# Altium schematic sheet MAG_MMC5983MA.SchDoc
size 420 x 297 mm; SheetNumber: 7; SheetTotal: 13
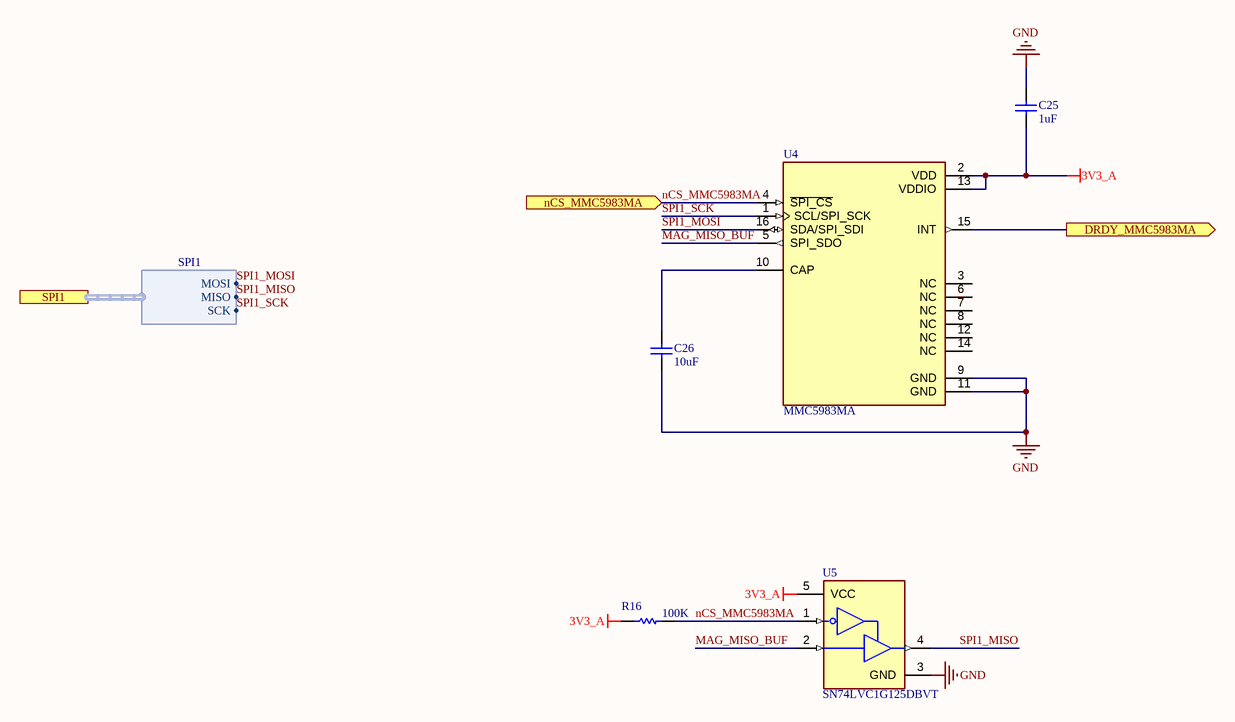
[diagram p0: MAG_MMC5983MA.SchDoc]

## Parts
C25  1uF  [CAPC1608X90X35LL15T15]
C26  10uF  [CAPC2013X145X50LL20T25]
R16  100K  [RESC1608X55X30ML20T10]
U4  MMC5983MA  [PQFN50P300X300X100-16N]
U5  SN74LVC1G125DBVT  [FP-DBV0005A-MFG]

## Ports
DRDY_MMC5983MA (out), nCS_MMC5983MA (in), SPI1 (harness SPI1)

## Harnesses
SPI1: MOSI, MISO, SCK

## Nets
3V3_A: C25.1 R16.2 U4.2(VDD) U4.13(VDDIO) U5.5(VCC)
GND: C25.2 C26.2 U4.9(GND) U4.11(GND) U5.3(GND)
DRDY_MMC5983MA: U4.15(INT) ; port DRDY_MMC5983MA
MAG_MISO_BUF: U4.5(SPI_SDO) U5.2(A)
nCS_MMC5983MA: R16.1 U4.4(~{SPI_CS}) U5.1(~{OE}) ; port nCS_MMC5983MA
SPI1_MISO: U5.4(Y) ; port SPI1.MISO
SPI1_MOSI: U4.16(SDA/SPI_SDI) ; port SPI1.MOSI
SPI1_SCK: U4.1(SCL/SPI_SCK) ; port SPI1.SCK
NetC26_1: C26.1 U4.10(CAP)

Not connected (* = marked no-connect by the designer): U4 3(NC) 6(NC) 7(NC) 8(NC) 12(NC) 14(NC)

## Notes on the sheet
- THIS DOCUMENT AND THE DATA DISCLOSED HEREIN OR
- HEREWITH IS THE PROPERTY OF ALTIUM LIMITED AND MAY
- DWG NO:
- REVISION
- REV:
- DESCRIPTION
- DATE
- APPROVED
- BE FREELY DISTRIBUTED IN WHOLE. NO RIGHTS ARE
- RESERVED OR EXPRESS OR IMPLIED WARANTEE GIVEN.
- ENG:
- APPROVALS
- PROJECT
- DSN:
- CHK:
- REFERENCE DOCUMENTS
- PROJECT REVISION:
- TITLE
- DOCUMENT REVISION:
- DESIGN ITEM:
- BOM:
- FAB DWG:
- PCB DWG:
- ASSY DWG:
- SCALE:
- A3
- SIZE
- CAGE CODE
- FILE NAME
- DWG NO.
- SHEET
- OF
- REV

## Library data of the parts
C25 = CMP-2006-02298-2: Manufacturer: Kemet; Part Number: C0603C105K4RACTU
C26 = CMP-2007-01044-1: Manufacturer: Kemet; Part Number: C0805C106K8RACTU
R16 = CMP-2000-01852-1: Part Number: RK73B1JTTD104J; Manufacturer: KOA Speer
U4 = CMP-051-000000-1: MMC5983 series Magnetic, Magnetometer Sensor Evaluation Board; MF: Memsic Inc.; Component Type: Standard; Price: None; Source: MMC5983MA.SchLib; Value: *; MP: MMC5983MA; Design Item ID: MMC5983MA; Package: VFLGA-16 Memsic Inc.; Pin Count: 16; Availability: In Stock; Purchase-URL: https://pricing.snapeda.com/search/part/MMC5983MA/?ref=eda; SnapEDA_Link: https://www.snapeda.com/parts/MMC5983MA/Memsic+Inc./view-part/?ref=snap; Check_prices: https://www.snapeda.com/parts/MMC5983MA/Memsic+Inc./view-part/?ref=eda
U5 = CMP-0859-00018-4: IC BUF NON-INVERT 5.5V SOT23-5; Manufacturer: Texas Instruments; Min Supply Voltage: 1.65V; Number Of Outputs: 1; Propagation Delay: 4.2ns; Logic Function Desc: Non-Inverting; Nominal Supply Current: 10uA; Standoff Height: 0mm; ComponentLink2Description: Datasheet; Temperature Range High: +125°C; Octopart: https://octopart.com/sn74lvc1g125dbvt-texas+instruments-1006799; Ambient Temperature Range Low: -40°C; Temperature: -40°C to +125°C; Mouser Description: Buffers & Line Drivers SNGL Bus Buffer Gate; Automotive: No; RoHS: TRUE; Device Class L2: Logic ICs; Ambient Temperature Range High: +125°C; ComponentLink2URL: http://www.ti.com/lit/ds/symlink/sn74lvc1g125.pdf; Height: 1.45mm; Number Of Circuits: 1; Device Class L1: Integrated Circuits (ICs); Max Supply Voltage: 5.5V; Manufacturer Part Number: SN74LVC1G125DBVT; Temperature Range Low: -40°C; Package: DBV0005A; Device Class L3: Logic Gates; Number Of Inputs: 1; Lead Free: Yes; Category: IC; Digikey Description: IC BUF NON-INVERT 5.5V SOT23-5